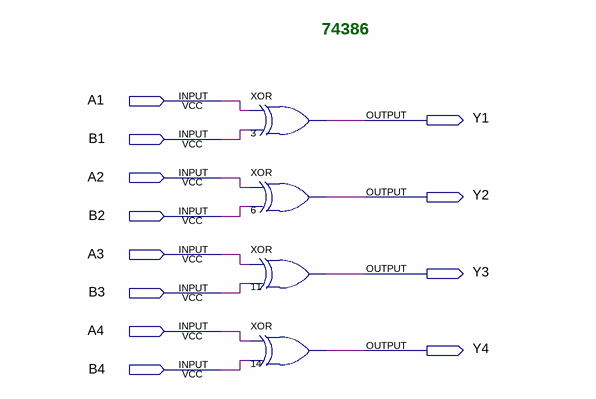
[diagram p0: schematic sheet]
// Quartus schematic 74386.bdf as structural Verilog: 4 symbols, 12 pins
module \74386  (
  input  A1,
  input  B1,
  input  A2,
  input  B2,
  input  A3,
  input  B3,
  input  A4,
  input  B4,
  output Y1,
  output Y2,
  output Y3,
  output Y4
);

  xor u_3 (Y1, A1, B1);
  xor u_6 (Y2, A2, B2);
  xor u_11 (Y3, A3, B3);
  xor u_14 (Y4, A4, B4);

  // Notes on the sheet:
  //   74386
endmodule
